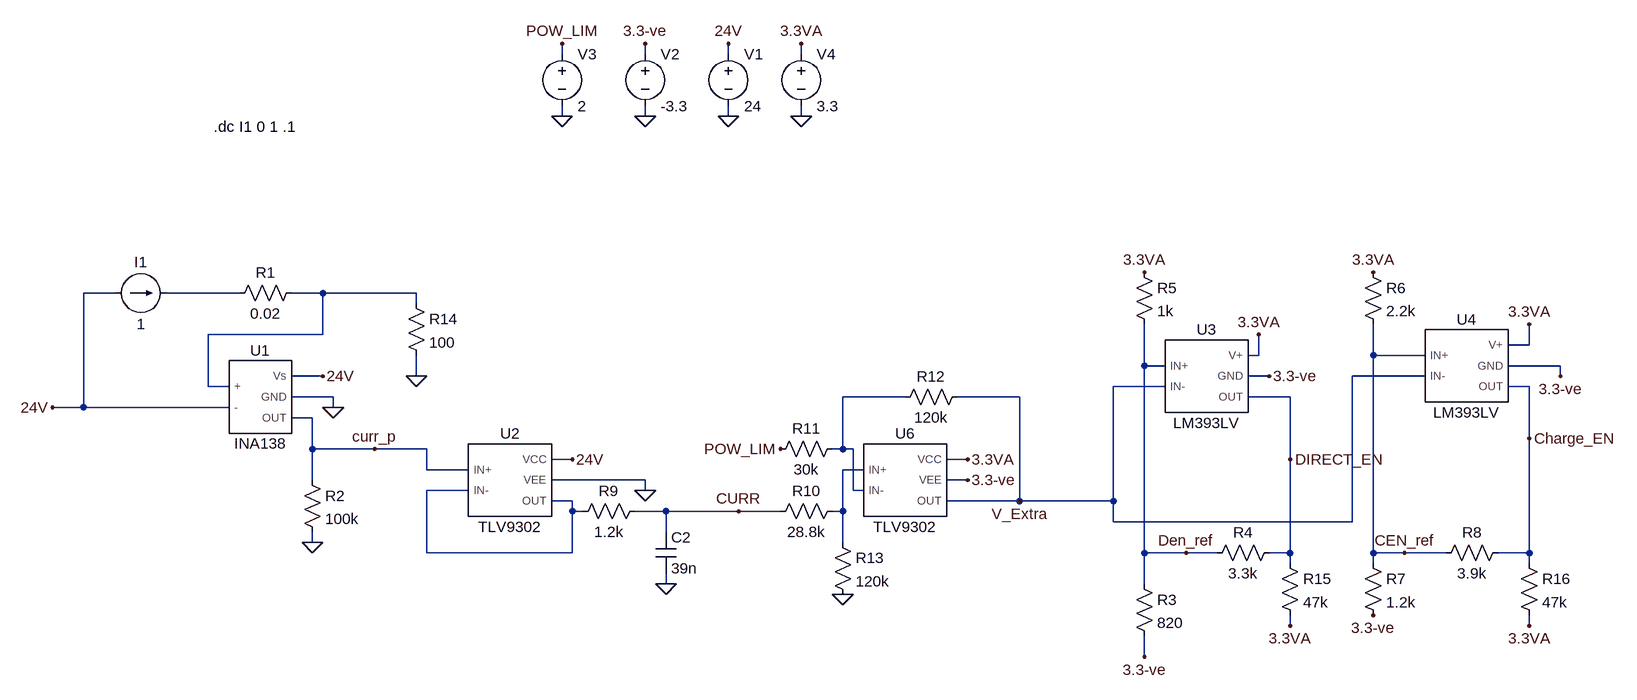
[diagram p0: schematic CurrentSense.asc]
CurrentSense.asc, the LTspice schematic file:
Version 4.1
SHEET 1 2408 700
WIRE 624 -368 624 -384
WIRE 752 -368 752 -384
WIRE 880 -368 880 -384
WIRE 992 -368 992 -384
WIRE 624 -272 624 -288
WIRE 752 -272 752 -288
WIRE 880 -272 880 -288
WIRE 992 -272 992 -288
WIRE -64 0 -112 0
WIRE 128 0 16 0
WIRE 256 0 208 0
WIRE 400 0 256 0
WIRE 400 16 400 0
WIRE 256 64 256 0
WIRE 256 64 80 64
WIRE 2112 80 2112 48
WIRE 2112 80 2080 80
WIRE 1696 96 1696 64
WIRE 1696 96 1680 96
WIRE 1872 96 1872 48
WIRE 1952 96 1872 96
WIRE 1520 112 1520 48
WIRE 1552 112 1520 112
WIRE 2160 112 2080 112
WIRE 256 128 208 128
WIRE 400 128 400 96
WIRE 1712 128 1680 128
WIRE 1952 128 1840 128
WIRE 2160 128 2160 112
WIRE 80 144 80 64
WIRE 112 144 80 144
WIRE 1552 144 1472 144
WIRE 2112 144 2080 144
WIRE 272 160 208 160
WIRE 1152 160 1056 160
WIRE 1328 160 1232 160
WIRE 1744 160 1680 160
WIRE -112 176 -112 0
WIRE -112 176 -160 176
WIRE 112 176 -112 176
WIRE 272 176 272 160
WIRE 240 192 208 192
WIRE 2112 224 2112 144
WIRE 240 240 240 192
WIRE 336 240 240 240
WIRE 416 240 336 240
WIRE 1056 240 1056 160
WIRE 1056 240 1040 240
WIRE 1072 240 1056 240
WIRE 640 256 608 256
WIRE 1248 256 1216 256
WIRE 1744 256 1744 160
WIRE 416 272 416 240
WIRE 480 272 416 272
WIRE 1088 272 1056 272
WIRE 240 288 240 240
WIRE 752 288 608 288
WIRE 1248 288 1216 288
WIRE 480 304 416 304
WIRE 752 304 752 288
WIRE 1072 304 1072 240
WIRE 1088 304 1072 304
WIRE 640 320 608 320
WIRE 1328 320 1328 160
WIRE 1328 320 1216 320
WIRE 1472 320 1472 144
WIRE 1472 320 1328 320
WIRE 640 336 640 320
WIRE 656 336 640 336
WIRE 784 336 736 336
WIRE 896 336 784 336
WIRE 960 336 896 336
WIRE 1056 336 1056 272
WIRE 1056 336 1040 336
WIRE 1472 352 1472 320
WIRE 1840 352 1840 128
WIRE 1840 352 1472 352
WIRE 784 368 784 336
WIRE 240 384 240 368
WIRE 1056 384 1056 336
WIRE 416 400 416 304
WIRE 640 400 640 336
WIRE 640 400 416 400
WIRE 1520 400 1520 112
WIRE 1584 400 1520 400
WIRE 1632 400 1584 400
WIRE 1744 400 1744 256
WIRE 1744 400 1712 400
WIRE 1872 400 1872 96
WIRE 1920 400 1872 400
WIRE 1984 400 1920 400
WIRE 2112 400 2112 224
WIRE 2112 400 2064 400
WIRE 1744 416 1744 400
WIRE 1872 416 1872 400
WIRE 2112 416 2112 400
WIRE 784 448 784 432
WIRE 1520 448 1520 400
WIRE 1744 512 1744 496
WIRE 2112 512 2112 496
WIRE 1520 560 1520 528
FLAG 272 176 0
FLAG 240 384 0
FLAG 896 336 CURR
FLAG 752 -272 0
FLAG 1696 64 3.3VA
FLAG 2112 48 3.3VA
FLAG 1744 256 DIRECT_EN
FLAG 624 -272 0
FLAG 624 -384 POW_LIM
FLAG 2112 224 Charge_EN
FLAG 992 -384 3.3VA
FLAG 992 -272 0
FLAG 784 448 0
FLAG 960 240 POW_LIM
FLAG 752 -384 3.3-ve
FLAG 880 -384 24V
FLAG 880 -272 0
FLAG 640 256 24V
FLAG 752 304 0
FLAG 1248 256 3.3VA
FLAG 1248 288 3.3-ve
FLAG 1328 320 V_Extra
FLAG 1584 400 Den_ref
FLAG 1520 -32 3.3VA
FLAG 1712 128 3.3-ve
FLAG 2160 128 3.3-ve
FLAG 1872 -32 3.3VA
FLAG 1520 560 3.3-ve
FLAG 1872 496 3.3-ve
FLAG 1056 464 0
FLAG 1920 400 CEN_ref
FLAG 256 128 24V
FLAG -160 176 24V
FLAG 336 240 curr_p
FLAG 400 128 0
FLAG 1744 512 3.3VA
FLAG 2112 512 3.3VA
SYMBOL res 224 -16 R90
WINDOW 0 0 56 VBottom 2
WINDOW 3 32 56 VTop 2
SYMATTR InstName R1
SYMATTR Value 0.02
SYMATTR SpiceLine tol=1
SYMBOL res 224 272 R0
SYMATTR InstName R2
SYMATTR Value 100k
SYMATTR SpiceLine tol=5
SYMBOL current -64 0 R270
WINDOW 0 32 40 VTop 2
WINDOW 3 -32 40 VBottom 2
WINDOW 123 0 0 Left 0
WINDOW 39 0 0 Left 0
SYMATTR InstName I1
SYMATTR Value 1
SYMBOL voltage 880 -384 R0
WINDOW 123 0 0 Left 0
WINDOW 39 0 0 Left 0
SYMATTR InstName V1
SYMATTR Value 24
SYMBOL voltage 752 -384 R0
WINDOW 123 0 0 Left 0
WINDOW 39 0 0 Left 0
SYMATTR InstName V2
SYMATTR Value -3.3
SYMBOL res 1504 432 R0
SYMATTR InstName R3
SYMATTR Value 820
SYMATTR SpiceLine tol=5
SYMBOL res 1728 384 R90
WINDOW 0 0 56 VBottom 2
WINDOW 3 32 56 VTop 2
SYMATTR InstName R4
SYMATTR Value 3.3k
SYMATTR SpiceLine tol=5
SYMBOL voltage 624 -384 R0
WINDOW 123 0 0 Left 0
WINDOW 39 0 0 Left 0
SYMATTR InstName V3
SYMATTR Value 2
SYMBOL res 1856 -48 R0
SYMATTR InstName R6
SYMATTR Value 2.2k
SYMATTR SpiceLine tol=2
SYMBOL res 1504 -48 R0
SYMATTR InstName R5
SYMATTR Value 1k
SYMATTR SpiceLine tol=2
SYMBOL res 1856 400 R0
SYMATTR InstName R7
SYMATTR Value 1.2k
SYMBOL res 2080 384 R90
WINDOW 0 0 56 VBottom 2
WINDOW 3 32 56 VTop 2
SYMATTR InstName R8
SYMATTR Value 3.9k
SYMBOL voltage 992 -384 R0
SYMATTR InstName V4
SYMATTR Value 3.3
SYMBOL res 752 320 R90
WINDOW 0 0 56 VBottom 2
WINDOW 3 32 56 VTop 2
SYMATTR InstName R9
SYMATTR Value 1.2k
SYMBOL cap 768 368 R0
SYMATTR InstName C2
SYMATTR Value 39n
SYMBOL res 1056 320 R90
WINDOW 0 0 56 VBottom 2
WINDOW 3 32 56 VTop 2
SYMATTR InstName R10
SYMATTR Value 28.8k
SYMBOL res 1056 224 R90
WINDOW 0 0 56 VBottom 2
WINDOW 3 32 56 VTop 2
SYMATTR InstName R11
SYMATTR Value 30k
SYMBOL res 1248 144 R90
WINDOW 0 0 56 VBottom 2
WINDOW 3 32 56 VTop 2
SYMATTR InstName R12
SYMATTR Value 120k
SYMBOL res 1040 368 R0
SYMATTR InstName R13
SYMATTR Value 120k
SYMBOL INA138 160 160 R0
SYMATTR InstName U1
SYMBOL LM393LV 1616 128 R0
SYMATTR InstName U3
SYMBOL LM393LV 2016 112 R0
SYMATTR InstName U4
SYMBOL TLV9302 544 288 R0
SYMATTR InstName U2
SYMBOL TLV9302 1152 288 R0
SYMATTR InstName U6
SYMBOL res 384 0 R0
SYMATTR InstName R14
SYMATTR Value 100
SYMBOL res 1728 400 R0
SYMATTR InstName R15
SYMATTR Value 47k
SYMBOL res 2096 400 R0
SYMATTR InstName R16
SYMATTR Value 47k
TEXT 88 -256 Left 2 !.dc I1 0 1 .1

The netlist it stands for:
* CurrentSense.asc
R1 N002 N001 0.02 tol=1
R2 curr_p 0 100k tol=5
I1 24V N001 1
V1 24V 0 24
V2 3.3-ve 0 -3.3
R3 Den_ref 3.3-ve 820 tol=5
R4 DIRECT_EN Den_ref 3.3k tol=5
V3 POW_LIM 0 2
R6 3.3VA CEN_ref 2.2k tol=2
R5 3.3VA Den_ref 1k tol=2
R7 CEN_ref 3.3-ve 1.2k
R8 Charge_EN CEN_ref 3.9k
V4 3.3VA 0 3.3
R9 CURR N005 1.2k
C2 CURR 0 39n
R10 N004 CURR 28.8k
R11 N003 POW_LIM 30k
R12 V_Extra N003 120k
R13 N004 0 120k
X§U1 N002 24V 24V 0 curr_p INA138  ; pins + - Vs GND OUT
X§U3 Den_ref V_Extra 3.3VA 3.3-ve DIRECT_EN LM393LV  ; pins IN+ IN- V+ GND OUT
X§U4 CEN_ref V_Extra 3.3VA 3.3-ve Charge_EN LM393LV  ; pins IN+ IN- V+ GND OUT
X§U2 curr_p N005 24V 0 N005 TLV9302  ; pins IN+ IN- VCC VEE OUT
X§U6 N004 N003 3.3VA 3.3-ve V_Extra TLV9302  ; pins IN+ IN- VCC VEE OUT
R14 N002 0 100
R15 DIRECT_EN 3.3VA 47k
R16 Charge_EN 3.3VA 47k
.dc I1 0 1 .1
.lib C:\Users\nithi\Downloads\sbom140a (2)\ina138.lib
.lib C:\Users\nithi\Downloads\snom697a\lm393lv.lib
.lib C:\Users\Tachi\Documents\robomaster_hardware\SupercapManager\SPICE_sims\libraries\tlv9302.lib
.backanno
.end